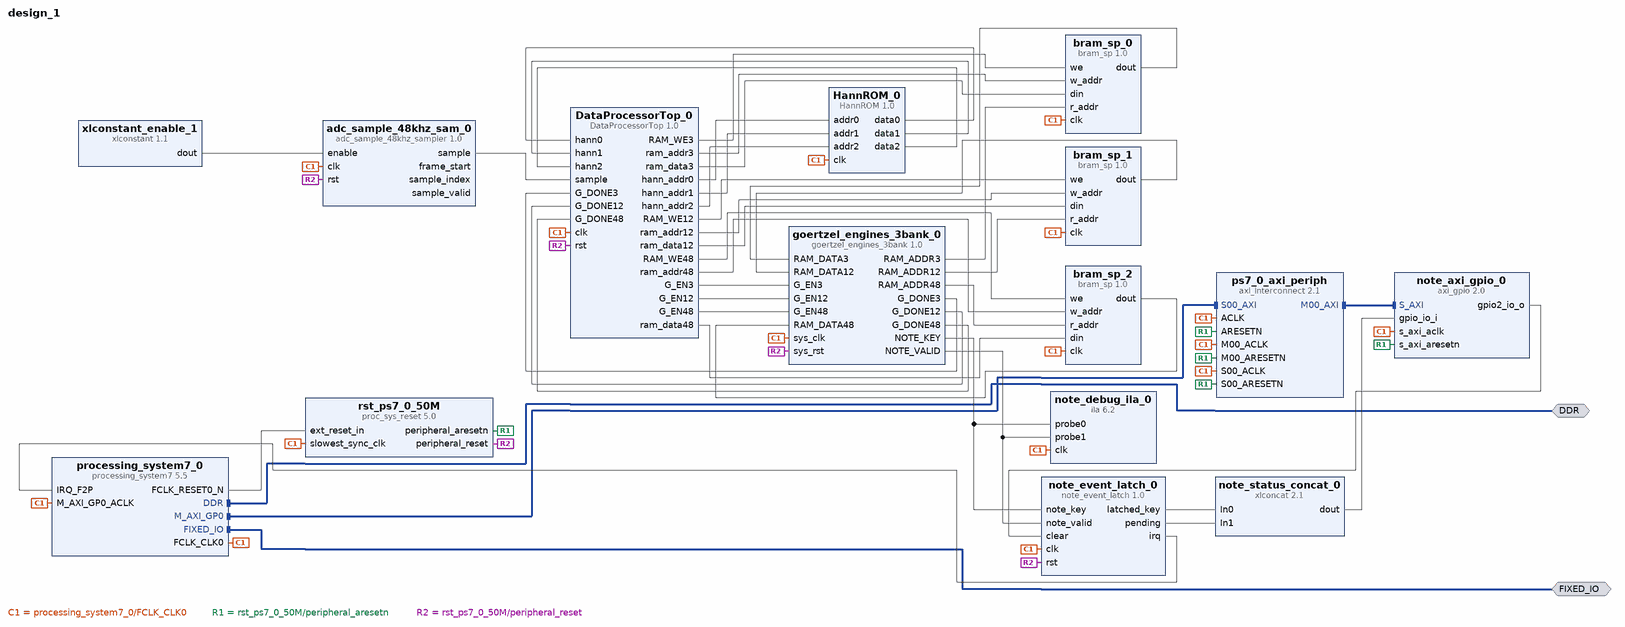
[diagram p0: block diagram of the top level]
# Vivado block design design_1, xc7z010clg400-1, Vivado 2023.2
create_bd_design design_1

create_bd_intf_port -mode Master -vlnv xilinx.com:interface:ddrx_rtl:1.0 DDR
create_bd_intf_port -mode Master -vlnv xilinx.com:display_processing_system7:fixedio_rtl:1.0 FIXED_IO

create_bd_cell -type ip -vlnv xilinx.com:ip:processing_system7:5.5 processing_system7_0
set_property -dict [list \
  CONFIG.PCW_APU_PERIPHERAL_FREQMHZ 667 \
  CONFIG.PCW_ENET0_ENET0_IO {MIO 16 .. 27} \
  CONFIG.PCW_ENET0_GRP_MDIO_ENABLE 1 \
  CONFIG.PCW_ENET0_GRP_MDIO_IO {MIO 52 .. 53} \
  CONFIG.PCW_ENET0_PERIPHERAL_ENABLE 1 \
  CONFIG.PCW_ENET0_RESET_ENABLE 0 \
  CONFIG.PCW_ENET_RESET_ENABLE 1 \
  CONFIG.PCW_ENET_RESET_SELECT {Share reset pin} \
  CONFIG.PCW_FPGA0_PERIPHERAL_FREQMHZ 50 \
  CONFIG.PCW_FPGA1_PERIPHERAL_FREQMHZ 50 \
  CONFIG.PCW_GPIO_MIO_GPIO_ENABLE 1 \
  CONFIG.PCW_GPIO_MIO_GPIO_IO MIO \
  CONFIG.PCW_I2C_RESET_ENABLE 1 \
  CONFIG.PCW_IRQ_F2P_INTR 1 \
  CONFIG.PCW_PERIPHERAL_BOARD_PRESET part0 \
  CONFIG.PCW_PRESET_BANK1_VOLTAGE {LVCMOS 1.8V} \
  CONFIG.PCW_QSPI_GRP_FBCLK_ENABLE 1 \
  CONFIG.PCW_QSPI_GRP_FBCLK_IO {MIO 8} \
  CONFIG.PCW_QSPI_GRP_SINGLE_SS_ENABLE 1 \
  CONFIG.PCW_QSPI_GRP_SINGLE_SS_IO {MIO 1 .. 6} \
  CONFIG.PCW_QSPI_PERIPHERAL_ENABLE 1 \
  CONFIG.PCW_QSPI_QSPI_IO {MIO 1 .. 6} \
  CONFIG.PCW_SD0_GRP_CD_ENABLE 1 \
  CONFIG.PCW_SD0_GRP_CD_IO {MIO 47} \
  CONFIG.PCW_SD0_GRP_WP_ENABLE 0 \
  CONFIG.PCW_SD0_PERIPHERAL_ENABLE 1 \
  CONFIG.PCW_SD0_SD0_IO {MIO 40 .. 45} \
  CONFIG.PCW_SDIO_PERIPHERAL_FREQMHZ 50 \
  CONFIG.PCW_SINGLE_QSPI_DATA_MODE x4 \
  CONFIG.PCW_UART1_PERIPHERAL_ENABLE 1 \
  CONFIG.PCW_UART1_UART1_IO {MIO 48 .. 49} \
  CONFIG.PCW_UART_PERIPHERAL_FREQMHZ 100 \
  CONFIG.PCW_UIPARAM_DDR_FREQ_MHZ 533.333333 \
  CONFIG.PCW_UIPARAM_DDR_MEMORY_TYPE {DDR 3 (Low Voltage)} \
  CONFIG.PCW_UIPARAM_DDR_PARTNO {MT41K256M16 RE-125} \
  CONFIG.PCW_USB0_PERIPHERAL_ENABLE 1 \
  CONFIG.PCW_USB0_RESET_ENABLE 1 \
  CONFIG.PCW_USB0_RESET_IO {MIO 46} \
  CONFIG.PCW_USB0_USB0_IO {MIO 28 .. 39} \
  CONFIG.PCW_USB_RESET_ENABLE 1 \
  CONFIG.PCW_USB_RESET_SELECT {Share reset pin} \
  CONFIG.PCW_USE_FABRIC_INTERRUPT 1 \
  CONFIG.preset None \
] [get_bd_cells processing_system7_0]
# 498 more settings of processing_system7_0 are not shown: defaults, MIO pin electricals, DDR timing, and values the tool derives
create_bd_cell -type ip -vlnv user.org:user:adc_sample_48khz_sampler:1.0 adc_sample_48khz_sam_0
set_property -dict [list \
  CONFIG.MEM_FILE C:/Users/Tim/Documents/ECE_615/final_project/final_project_hardware/final_project_hardware.srcs/sources_1/new/adc_samples.mem \
] [get_bd_cells adc_sample_48khz_sam_0]
create_bd_cell -type ip -vlnv xilinx.com:ip:proc_sys_reset:5.0 rst_ps7_0_50M
create_bd_cell -type ip -vlnv xilinx.com:ip:xlconstant:1.1 xlconstant_enable_1
set_property -dict {CONFIG.CONST_VAL 1 CONFIG.CONST_WIDTH 1} [get_bd_cells xlconstant_enable_1]
create_bd_cell -type ip -vlnv user.org:user:goertzel_engines_3bank:1.0 goertzel_engines_3bank_0
set_property -dict [list \
  CONFIG.BANK1_COEFF_FILE C:/Users/Tim/Documents/ECE_615/final_project/final_project_hardware/final_project_hardware.srcs/sources_1/new/goertzel_bank1_coeff.mem \
  CONFIG.BANK2_COEFF_FILE C:/Users/Tim/Documents/ECE_615/final_project/final_project_hardware/final_project_hardware.srcs/sources_1/new/goertzel_bank2_coeff.mem \
  CONFIG.BANK3_COEFF_FILE C:/Users/Tim/Documents/ECE_615/final_project/final_project_hardware/final_project_hardware.srcs/sources_1/new/goertzel_bank3_coeff.mem \
] [get_bd_cells goertzel_engines_3bank_0]
create_bd_cell -type ip -vlnv xilinx.com:ip:ila:6.2 note_debug_ila_0
set_property -dict [list \
  CONFIG.C_DATA_DEPTH 1024 \
  CONFIG.C_ENABLE_ILA_AXI_MON false \
  CONFIG.C_MONITOR_TYPE Native \
  CONFIG.C_NUM_OF_PROBES 2 \
  CONFIG.C_PROBE0_WIDTH 7 \
  CONFIG.C_PROBE1_WIDTH 1 \
] [get_bd_cells note_debug_ila_0]
create_bd_cell -type ip -vlnv user.org:user:DataProcessorTop:1.0 DataProcessorTop_0
create_bd_cell -type ip -vlnv user.org:user:HannROM:1.0 HannROM_0
create_bd_cell -type ip -vlnv user.org:user:bram_sp:1.0 bram_sp_0
set_property -dict {CONFIG.ADDR_WIDTH 12 CONFIG.DATA_WIDTH 24} [get_bd_cells bram_sp_0]
create_bd_cell -type ip -vlnv user.org:user:bram_sp:1.0 bram_sp_1
set_property -dict {CONFIG.ADDR_WIDTH 12 CONFIG.DATA_WIDTH 24} [get_bd_cells bram_sp_1]
create_bd_cell -type ip -vlnv user.org:user:bram_sp:1.0 bram_sp_2
set_property -dict {CONFIG.ADDR_WIDTH 12 CONFIG.DATA_WIDTH 24} [get_bd_cells bram_sp_2]
create_bd_cell -type ip -vlnv user.org:user:note_event_latch:1.0 note_event_latch_0
create_bd_cell -type ip -vlnv xilinx.com:ip:axi_gpio:2.0 note_axi_gpio_0
set_property -dict [list \
  CONFIG.C_ALL_INPUTS 1 \
  CONFIG.C_ALL_OUTPUTS_2 1 \
  CONFIG.C_GPIO2_WIDTH 1 \
  CONFIG.C_GPIO_WIDTH 8 \
  CONFIG.C_INTERRUPT_PRESENT 0 \
  CONFIG.C_IS_DUAL 1 \
] [get_bd_cells note_axi_gpio_0]
create_bd_cell -type ip -vlnv xilinx.com:ip:xlconcat:2.1 note_status_concat_0
set_property -dict {CONFIG.IN0_WIDTH 7 CONFIG.IN1_WIDTH 1 CONFIG.NUM_PORTS 2} [get_bd_cells note_status_concat_0]
create_bd_cell -type ip -vlnv xilinx.com:ip:axi_interconnect:2.1 ps7_0_axi_periph
set_property -dict {CONFIG.NUM_MI 1} [get_bd_cells ps7_0_axi_periph]

# ---- connections ----

connect_bd_intf_net [get_bd_intf_ports DDR] [get_bd_intf_pins processing_system7_0/DDR]
connect_bd_intf_net [get_bd_intf_ports FIXED_IO] [get_bd_intf_pins processing_system7_0/FIXED_IO]
connect_bd_intf_net [get_bd_intf_pins processing_system7_0/M_AXI_GP0] [get_bd_intf_pins ps7_0_axi_periph/S00_AXI]
connect_bd_intf_net [get_bd_intf_pins ps7_0_axi_periph/M00_AXI] [get_bd_intf_pins note_axi_gpio_0/S_AXI]
connect_bd_net [get_bd_pins DataProcessorTop_0/G_EN3] [get_bd_pins goertzel_engines_3bank_0/G_EN3]
connect_bd_net [get_bd_pins DataProcessorTop_0/G_EN12] [get_bd_pins goertzel_engines_3bank_0/G_EN12]
connect_bd_net [get_bd_pins DataProcessorTop_0/G_EN48] [get_bd_pins goertzel_engines_3bank_0/G_EN48]
connect_bd_net [get_bd_pins DataProcessorTop_0/RAM_WE3] [get_bd_pins bram_sp_0/we]
connect_bd_net [get_bd_pins DataProcessorTop_0/RAM_WE12] [get_bd_pins bram_sp_1/we]
connect_bd_net [get_bd_pins DataProcessorTop_0/RAM_WE48] [get_bd_pins bram_sp_2/we]
connect_bd_net [get_bd_pins DataProcessorTop_0/hann_addr0] [get_bd_pins HannROM_0/addr0]
connect_bd_net [get_bd_pins DataProcessorTop_0/hann_addr1] [get_bd_pins HannROM_0/addr1]
connect_bd_net [get_bd_pins DataProcessorTop_0/hann_addr2] [get_bd_pins HannROM_0/addr2]
connect_bd_net [get_bd_pins DataProcessorTop_0/ram_addr3] [get_bd_pins bram_sp_0/w_addr]
connect_bd_net [get_bd_pins DataProcessorTop_0/ram_addr12] [get_bd_pins bram_sp_1/w_addr]
connect_bd_net [get_bd_pins DataProcessorTop_0/ram_addr48] [get_bd_pins bram_sp_2/w_addr]
connect_bd_net [get_bd_pins DataProcessorTop_0/ram_data3] [get_bd_pins bram_sp_0/din]
connect_bd_net [get_bd_pins DataProcessorTop_0/ram_data12] [get_bd_pins bram_sp_1/din]
connect_bd_net [get_bd_pins DataProcessorTop_0/ram_data48] [get_bd_pins bram_sp_2/din]
connect_bd_net [get_bd_pins HannROM_0/data0] [get_bd_pins DataProcessorTop_0/hann0]
connect_bd_net [get_bd_pins HannROM_0/data1] [get_bd_pins DataProcessorTop_0/hann1]
connect_bd_net [get_bd_pins HannROM_0/data2] [get_bd_pins DataProcessorTop_0/hann2]
# net adc_sample_48khz_sam_0_frame_start has one end: adc_sample_48khz_sam_0/frame_start
connect_bd_net [get_bd_pins adc_sample_48khz_sam_0/sample] [get_bd_pins DataProcessorTop_0/sample]
# net adc_sample_48khz_sam_0_sample_index has one end: adc_sample_48khz_sam_0/sample_index
# net adc_sample_48khz_sam_0_sample_valid has one end: adc_sample_48khz_sam_0/sample_valid
connect_bd_net [get_bd_pins bram_sp_0/dout] [get_bd_pins goertzel_engines_3bank_0/RAM_DATA3]
connect_bd_net [get_bd_pins bram_sp_1/dout] [get_bd_pins goertzel_engines_3bank_0/RAM_DATA12]
connect_bd_net [get_bd_pins bram_sp_2/dout] [get_bd_pins goertzel_engines_3bank_0/RAM_DATA48]
connect_bd_net [get_bd_pins goertzel_engines_3bank_0/G_DONE3] [get_bd_pins DataProcessorTop_0/G_DONE3]
connect_bd_net [get_bd_pins goertzel_engines_3bank_0/G_DONE12] [get_bd_pins DataProcessorTop_0/G_DONE12]
connect_bd_net [get_bd_pins goertzel_engines_3bank_0/G_DONE48] [get_bd_pins DataProcessorTop_0/G_DONE48]
connect_bd_net [get_bd_pins goertzel_engines_3bank_0/NOTE_KEY] [get_bd_pins note_debug_ila_0/probe0] [get_bd_pins note_event_latch_0/note_key]
connect_bd_net [get_bd_pins goertzel_engines_3bank_0/NOTE_VALID] [get_bd_pins note_debug_ila_0/probe1] [get_bd_pins note_event_latch_0/note_valid]
connect_bd_net [get_bd_pins goertzel_engines_3bank_0/RAM_ADDR3] [get_bd_pins bram_sp_0/r_addr]
connect_bd_net [get_bd_pins goertzel_engines_3bank_0/RAM_ADDR12] [get_bd_pins bram_sp_1/r_addr]
connect_bd_net [get_bd_pins goertzel_engines_3bank_0/RAM_ADDR48] [get_bd_pins bram_sp_2/r_addr]
connect_bd_net [get_bd_pins note_axi_gpio_0/gpio2_io_o] [get_bd_pins note_event_latch_0/clear]
connect_bd_net [get_bd_pins note_event_latch_0/irq] [get_bd_pins processing_system7_0/IRQ_F2P]
connect_bd_net [get_bd_pins note_event_latch_0/latched_key] [get_bd_pins note_status_concat_0/In0]
connect_bd_net [get_bd_pins note_event_latch_0/pending] [get_bd_pins note_status_concat_0/In1]
connect_bd_net [get_bd_pins note_status_concat_0/dout] [get_bd_pins note_axi_gpio_0/gpio_io_i]
connect_bd_net [get_bd_pins processing_system7_0/FCLK_CLK0] \
  [get_bd_pins rst_ps7_0_50M/slowest_sync_clk] [get_bd_pins processing_system7_0/M_AXI_GP0_ACLK] \
  [get_bd_pins note_debug_ila_0/clk] [get_bd_pins HannROM_0/clk] [get_bd_pins bram_sp_0/clk] [get_bd_pins bram_sp_1/clk] \
  [get_bd_pins bram_sp_2/clk] [get_bd_pins note_event_latch_0/clk] [get_bd_pins note_axi_gpio_0/s_axi_aclk] \
  [get_bd_pins ps7_0_axi_periph/ACLK] [get_bd_pins ps7_0_axi_periph/S00_ACLK] [get_bd_pins ps7_0_axi_periph/M00_ACLK] \
  [get_bd_pins DataProcessorTop_0/clk] [get_bd_pins adc_sample_48khz_sam_0/clk] \
  [get_bd_pins goertzel_engines_3bank_0/sys_clk]
connect_bd_net [get_bd_pins processing_system7_0/FCLK_RESET0_N] [get_bd_pins rst_ps7_0_50M/ext_reset_in]
connect_bd_net [get_bd_pins rst_ps7_0_50M/peripheral_aresetn] \
  [get_bd_pins note_axi_gpio_0/s_axi_aresetn] [get_bd_pins ps7_0_axi_periph/S00_ARESETN] \
  [get_bd_pins ps7_0_axi_periph/M00_ARESETN] [get_bd_pins ps7_0_axi_periph/ARESETN]
connect_bd_net [get_bd_pins rst_ps7_0_50M/peripheral_reset] \
  [get_bd_pins note_event_latch_0/rst] [get_bd_pins DataProcessorTop_0/rst] [get_bd_pins adc_sample_48khz_sam_0/rst] \
  [get_bd_pins goertzel_engines_3bank_0/sys_rst]
connect_bd_net [get_bd_pins xlconstant_enable_1/dout] [get_bd_pins adc_sample_48khz_sam_0/enable]

# ---- address map ----
assign_bd_address -offset 0x41200000 -range 64K -target_address_space [get_bd_addr_spaces processing_system7_0/Data] [get_bd_addr_segs note_axi_gpio_0/S_AXI/Reg]

validate_bd_design
save_bd_design
